# Altium schematic sheet 红外解码.SchDoc
size A4
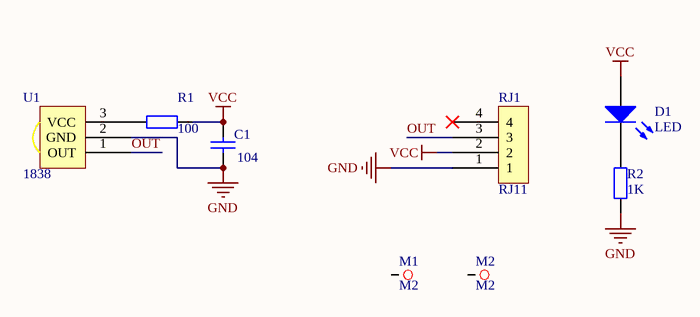
[diagram p0: 红外解码.SchDoc]

## Parts
C1  value 104  [0603_C]  (hidden comment: Cap)
D1  LED  [0805]
M1  M2  [M2]
M2  M2  [M2]
R1  value 100  [0603_R]  (hidden comment: Res2)
R2  value 1K  [0603_R]  (hidden comment: Res2)
RJ1  RJ11  [RJ11]
U1  1838  [1838]

## Nets
GND: C1.1 R2.1 RJ1.1 U1.2(GND)
VCC: C1.2 D1.1(A) R1.2 RJ1.2
OUT: RJ1.3 U1.1(OUT)
NetD1_2: D1.2(K) R2.2
NetR1_1: R1.1 U1.3(VCC)

Not connected (* = marked no-connect by the designer): M1 0; M2 0; RJ1 4*

## Library data of the parts
C1 = Cap: Capacitor; Published: 8-Jun-2000; LatestRevisionDate: 17-Jul-2002; LatestRevisionNote: Re-released for DXP Platform.; PackageReference: RAD-0.3; Publisher: Altium Limited
D1 = LED1: Typical RED GaAs LED; Published: 8-Jun-2000; LatestRevisionDate: 08-Jul-2005; LatestRevisionNote: Mech Layer 1 removed.; PackageReference: LED-1; Publisher: Altium Limited
M1 M2 = M3
R1 R2 = Res2: Resistor; Published: 8-Jun-2000; LatestRevisionDate: 17-Jul-2002; LatestRevisionNote: Re-released for DXP Platform.; PackageReference: AXIAL-0.4; Publisher: Altium Limited